# EAGLE design AJH_as3320_21_4hp (EAGLE 9.5.2)
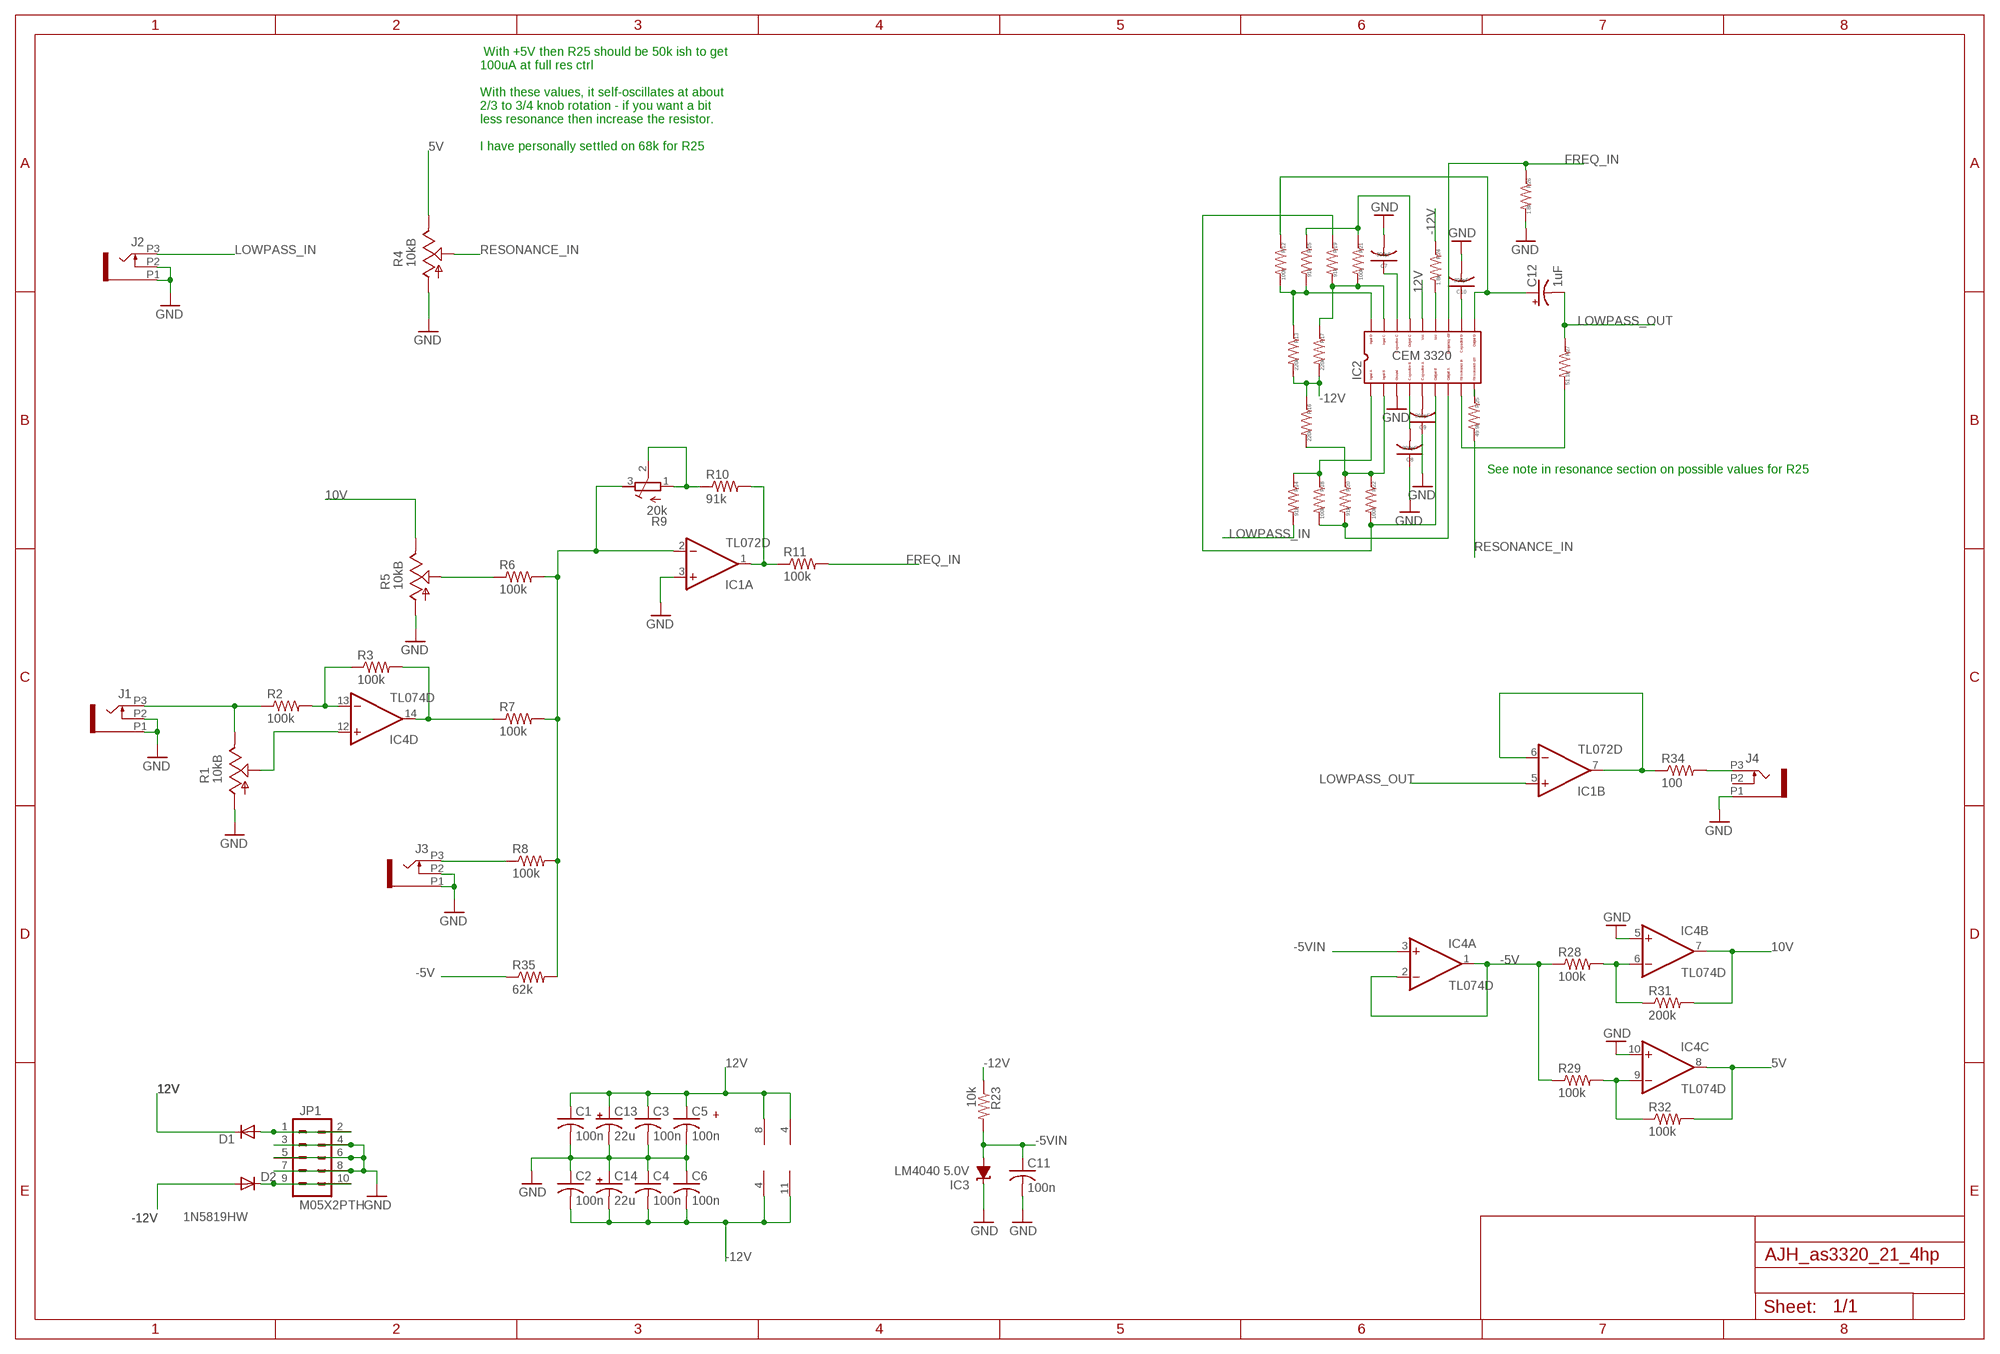
[diagram p0: schematic, sheet 1]

## Parts
C1  100n  C-USC0603  [C0603]
C2  100n  C-USC0603  [C0603]
C3  100n  C-USC0603  [C0603]
C4  100n  C-USC0603  [C0603]
C5  100n  C-USC0603  [C0603]
C6  100n  C-USC0603  [C0603]
C7  300pF  C-USC0603  [C0603]
C8  300pF  C-USC0603  [C0603]
C9  300pF  C-USC0603  [C0603]
C10  300pF  C-USC0603  [C0603]
C11  100n  C-USC0603  [C0603]
C12  1uF  CPOL-USB  [PANASONIC_B]
C13  22u  CPOL-USB  [PANASONIC_B]
C14  22u  CPOL-USB  [PANASONIC_B]
D1  1N5819HW  DIODE-SOD123  [SOD123]
D2  1N5819HW  DIODE-SOD123  [SOD123]
IC1  TL072D  [SO08]
IC2  CEM3320QFN24  [QFN24]
IC3  LM4040 5.0V  LM4041C12DBZ  [DBZ_R-PDSO-G3]
IC4  TL074D  [SO14]
J1  PJ301_THONKICONN6  [WQP_PJ_301M6]
J2  PJ301_THONKICONN6  [WQP_PJ_301M6]
J3  PJ301_THONKICONN6  [WQP_PJ_301M6]
J4  PJ301_THONKICONN6  [WQP_PJ_301M6]
JP1  M05X2PTH  [AVR_ICSP]
R1  10kB  POT_USVERTICAL  [ALPS_POT_VERTICAL]
R2  100k  R-US_R0603  [R0603]
R3  100k  R-US_R0603  [R0603]
R4  10kB  POT_USVERTICAL  [ALPS_POT_VERTICAL]
R5  10kB  POT_USVERTICAL  [ALPS_POT_VERTICAL]
R6  100k  R-US_R0603  [R0603]
R7  100k  R-US_R0603  [R0603]
R8  100k  R-US_R0603  [R0603]
R9  20k  R-TRIMM3296X  [RTRIM3296X]
R10  91k  R-US_R0603  [R0603]
R11  100k  R-US_R0603  [R0603]
R12  100k  R-US_R0603  [R0603]
R13  220k  R-US_R0603  [R0603]
R14  91k  R-US_R0603  [R0603]
R15  91k  R-US_R0603  [R0603]
R16  220k  R-US_R0603  [R0603]
R17  220k  R-US_R0603  [R0603]
R18  100k  R-US_R0603  [R0603]
R19  91k  R-US_R0603  [R0603]
R20  91k  R-US_R0603  [R0603]
R21  100k  R-US_R0603  [R0603]
R22  100k  R-US_R0603  [R0603]
R23  10k  R-US_R0603  [R0603]
R24  1.8k  R-US_R0603  [R0603]
R25  49.9k  R-US_R0603  [R0603]
R26  1.8k  R-US_R0603  [R0603]
R27  51.1k  R-US_R0603  [R0603]
R28  100k  R-US_R0603  [R0603]
R29  100k  R-US_R0603  [R0603]
R31  200k  R-US_R0603  [R0603]
R32  100k  R-US_R0603  [R0603]
R34  100  R-US_R0603  [R0603]
R35  62k  R-US_R0603  [R0603]

## Nets
5V [power]: IC4.8(C:OUT) R4.P$1(E) R32.2
10V [power]: IC4.7(B:OUT) R5.P$1(E) R31.2
12V [power]: C1.1 C3.1 C5.1 C13.+ D1.C IC1.8(P:V+) IC2.P$22 IC4.4(P:V+)
-5V [power]: IC4.1(A:OUT) IC4.2(A:-IN) R28.1 R29.1 R35.1
-5VIN [power]: C11.1 IC3.2(A) IC4.3(A:+IN) R23.2
-12V [power]: C2.2 C4.2 C6.2 C14.- D2.A IC1.4(P:V-) IC4.11(P:V-) R13.2 R16.1 R17.2 R23.1 R24.1
FREQ_IN: IC2.P$19 R11.2 R26.1
GND [power]: C1.2 C2.1 C3.2 C4.1 C5.2 C6.1 C7.2 C8.1 C9.1 C10.2 C11.2 C13.- C14.+ IC1.3(A:+IN) IC2.P$7 IC3.1(C) IC4.5(B:+IN) IC4.10(C:+IN) J1.P1 J1.P2 J2.P1 J2.P2 J3.P1 J3.P2 J4.P1 JP1.3 JP1.4 JP1.5 JP1.6 JP1.7 JP1.8 R1.P$3(A) R4.P$3(A) R5.P$3(A) R26.2
LOWPASS_IN: J2.P3 R14.2
LOWPASS_OUT: C12.- IC1.5(B:+IN) R27.1
N$1: IC1.6(B:-IN) IC1.7(B:OUT) R34.1
N$2: IC2.P$3 R12.2 R13.1 R15.2
N$3: IC4.12(D:+IN) R1.P$2(S)
N$4: R5.P$2(S) R6.1
N$5: IC4.13(D:-IN) R2.2 R3.1
N$6: D1.A JP1.1 JP1.2
N$7: IC1.2(A:-IN) R6.2 R7.2 R8.2 R9.3(A) R35.2
N$8: IC1.1(A:OUT) R10.2 R11.1
N$10: J3.P3 R8.1
N$11: J4.P3 R34.2
N$12: IC4.14(D:OUT) R3.2 R7.1
N$13: IC4.9(C:-IN) R29.2 R32.1
N$15: IC4.6(B:-IN) R28.2 R31.1
N$20: D2.C JP1.9 JP1.10
N$40: C7.1 IC2.P$24
N$41 [nearfilter]: C8.2 IC2.P$8
N$42 [nearfilter]: C9.2 IC2.P$9
N$43 [nearfilter]: C10.1 IC2.P$17
N$44 [nearfilter]: IC2.P$15 R25.1
N$45 [nearfilter]: IC2.P$4 R14.1 R18.1
N$46 [nearfilter]: IC2.P$12 R18.2 R20.2
N$47 [nearfilter]: IC2.P$11 R19.1 R22.2
N$49 [nearfilter]: IC2.P$23 R15.1 R21.1
N$50 [nearfilter]: C12.+ IC2.P$16 R12.1
N$51 [nearfilter]: IC2.P$14 R27.2
N$52 [nearfilter]: IC2.P$5 R16.2 R20.1 R22.1
N$53 [nearfilter]: IC2.P$2 R17.1 R19.2 R21.2
N$54 [nearfilter]: IC2.P$20 R24.2
N$55: R9.1(E) R9.2(S) R10.1
N$82: J1.P3 R1.P$1(E) R2.1
RESONANCE_IN: R4.P$2(S) R25.2
Unconnected: J4.P2

## Notes on the sheet
- With +5V then R25 should be 50k ish to get
  100uA at full res ctrl
  
  With these values, it self-oscillates at about
  2/3 to 3/4 knob rotation - if you want a bit
  less resonance then increase the resistor.
  
  I have personally settled on 68k for R25
- See note in resonance section on possible values for R25
- +

## Library data of the parts
C1-C6 C11 = rcl:C-US: CAPACITOR, American symbol
C7-C10 = rcl:C-US: CAPACITOR, American symbol; SPICEPREFIX: C
C12 = rcl:CPOL-US: POLARIZED CAPACITOR, American symbol; SPICEPREFIX: C
C13 C14 = rcl:CPOL-US: POLARIZED CAPACITOR, American symbol
D1 D2 = diode:DIODE-: DIODE
IC1 = linear:TL072: OP AMP
IC2 = CEM:CEM3320: CEM 3330 VCF
IC3 = texas:LM4041: PRECISION MICROPOWER SHUNT VOLTAGE REFERENCE Source: http://focus.ti.com/lit/ds/slcs146e/slcs146e.pdf
IC4 = linear:TL074: OP AMP
J1-J4 = og-pj301_variations:PJ301_THONKICONN
JP1 = og-header:M05X2: Header 5x2 Standard 10-pin dual row 0.1" header. Commonly used with AVR-ISP. Use with Spark Fun Electronics SKU: PRT-00778
R1 R4 R5 = og-pots:POT_US
R2 R3 R6-R8 R10 R11 R23 R28 R29 R31 R32 R34 R35 = resistor:R-US_: RESISTOR, American symbol
R9 = rcl:R-TRIMM: Trimm resistor
R12-R22 R24-R27 = rcl:R-US_: RESISTOR, American symbol; SPICEPREFIX: R

## Net classes
0 default: width 0.152 mm
1 power: width 0.406 mm
2 nearfilter: width 0.152 mm

## Board
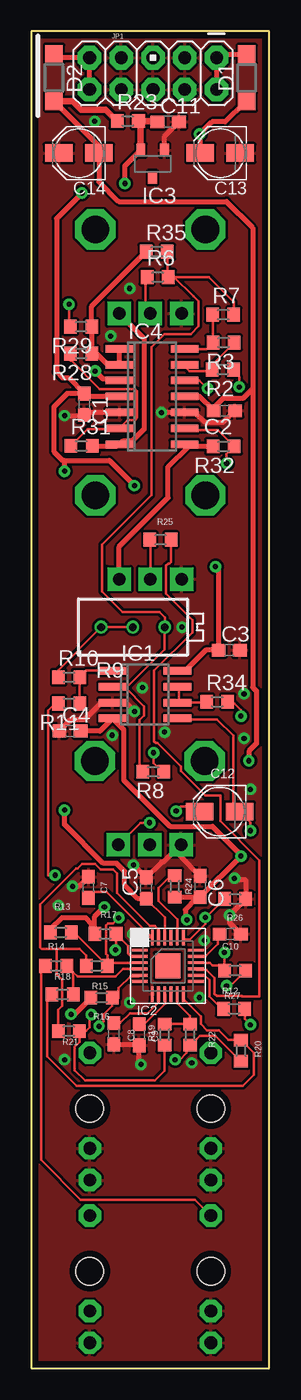
[diagram p1: board, top side]
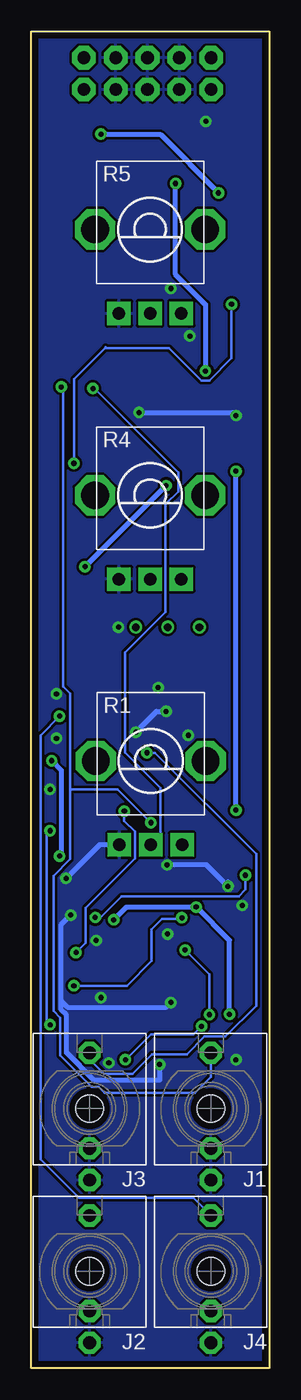
[diagram p2: board, bottom side, seen from below]

Size 19.03 x 106.76 mm. Coordinates in mm from the lower left corner, seen from the top.
Outline: 0,0 19.03,0 19.03,106.76 0,106.76 0,0
Copper layers (1*16): Top 0.035mm / dielectric 1.5mm / Bottom 0.035mm
Design rules "Mutable_PCBCart-Standard": minimum track width 8mil, minimum drill 0.4mm, track to track 8mil, track to pad 8mil, pad to pad 8mil, via to via 8mil, smd to smd 8mil, copper to edge 20mil, drill to drill 8mil, minimum pad ring 8mil, minimum via ring 10mil, stop-mask expansion 3mil, vias tented up to drill 25mil, thermal gap 8mil

### Footprints (pad centres in the part's own frame; a part is rotated, then mirrored left to right if it is on the bottom)
C0603 = smd 1.1 x 1: 1 -0.85,0; 2 0.85,0
PANASONIC_B = smd 2.2 x 1.4: + 1.6,0; - -1.6,0
SOD123 = smd 1.4 x 1.4: A 1.9,0; C -1.9,0
SO08 = smd 0.6 x 2.2: 1 -1.905,-2.6; 2 -0.635,-2.6; 3 0.635,-2.6; 4 1.905,-2.6; 5 1.905,2.6; 6 0.635,2.6; 7 -0.635,2.6; 8 -1.905,2.6
QFN24 = smd 1.25 x 0.23: P$1 -2.25,1.25; P$2 -2.25,0.75; P$3 -2.25,0.25; P$4 -2.25,-0.25; P$5 -2.25,-0.75; P$6 -2.25,-1.25; P$13 2.25,-1.25; P$14 2.25,-0.75; P$15 2.25,-0.25; P$16 2.25,0.25; P$17 2.25,0.75; P$18 2.25,1.25 | smd 0.23 x 1.25: P$7 -1.25,-2.25; P$8 -0.75,-2.25; P$9 -0.25,-2.25; P$10 0.25,-2.25; P$11 0.75,-2.25; P$12 1.25,-2.25; P$19 1.25,2.25; P$20 0.75,2.25; P$21 0.25,2.25; P$22 -0.25,2.25; P$23 -0.75,2.25; P$24 -1.25,2.25 | smd 2 x 2: PAD 0,0
DBZ_R-PDSO-G3 = smd 0.7 x 1: 1 -0.95,-1.1; 2 0.95,-1.1; 3 0,1.1
SO14 = smd 0.6 x 2.2: 1 -3.81,-2.6; 2 -2.54,-2.6; 3 -1.27,-2.6; 4 0,-2.6; 5 1.27,-2.6; 6 2.54,-2.6; 7 3.81,-2.6; 8 3.81,2.6; 9 2.54,2.6; 10 1.27,2.6; 11 0,2.6; 12 -1.27,2.6; 13 -2.54,2.6; 14 -3.81,2.6
WQP_PJ_301M6 = drill 1.016 pad 1.778 octagon: P1 0,-5.715; P2 0,-3.175; P3 0,4.445 | hole 2.2: 0,0
AVR_ICSP = drill 1.016 pad 1.88 octagon: 1 -1.27,5.08; 2 1.27,5.08; 3 -1.27,2.54; 4 1.27,2.54; 5 -1.27,0; 6 1.27,0; 7 -1.27,-2.54; 8 1.27,-2.54; 9 -1.27,-5.08; 10 1.27,-5.08
ALPS_POT_VERTICAL = drill 1 pad 1.88 square: P$1 -2.5,6.7; P$2 0,6.7; P$3 2.5,6.7 | drill 2.2 pad 3.175 octagon: P$4 -4.4,0; P$5 4.4,0
R0603 = smd 1 x 1.1: 1 -0.85,0; 2 0.85,0
RTRIM3296X = drill 0.61: 1 0,-2.54; 2 0,0; 3 0,2.54

### Placement (x,y rotation side)
C1  4.24,76.98 270 top
C2  15.44,76.46 180 top
C3  15.83,57.34 0 top
C4  3.1,50.88 0 top
C5  9.19,38.34 90 top
C6  13.5,38.47 270 top
C7  4.57,38.39 90 top
C8  6.6,26.71 90 top
C9  8.64,26.63 90 top
C10  15.91,34.67 0 top
C11  10.95,99.53 0 top
C12  15.06,44.45 180 top
C13  15.11,97.03 180 top
C14  3.81,97.03 180 top
D1  17.23,103.04 90 top
D2  1.83,103.06 270 top
IC1  9.09,53.79 270 top
IC2  10.92,32.13 0 top
IC3  9.7,96.17 180 top
IC4  9.65,77.6 270 top
J1  4.67,20.74 0 bottom
J2  14.37,7.75 0 bottom
J3  14.37,20.74 0 bottom
J4  4.67,7.75 0 bottom
JP1  9.74,103.38 270 top
R1  9.47,48.49 180 bottom
R2  15.32,79.75 180 top
R3  15.38,81.9 180 top
R4  9.53,69.71 180 bottom
R5  9.53,90.93 180 bottom
R6  10.11,87.13 0 top
R7  15.35,84.13 0 top
R8  9.75,47.63 180 top
R9  8.13,59.18 270 top
R10  3.02,55.17 0 top
R11  3.02,53.09 180 top
R12  16.3,31.75 0 top
R13  2.37,34.8 180 top
R14  1.99,32.13 180 top
R15  5.25,32.13 0 top
R16  5.63,29.59 0 top
R17  5.93,34.67 180 top
R18  2.5,29.84 180 top
R19  10.67,26.63 270 top
R20  16.76,25.36 90 top
R21  3.01,26.92 0 top
R22  12.7,26.63 90 top
R23  7.73,99.59 0 top
R24  11.47,38.48 90 top
R25  10.33,66.17 180 top
R26  16.3,37.47 0 top
R27  16.22,28.7 180 top
R28  3.98,81.03 180 top
R29  3.98,83.17 180 top
R31  4.02,73.65 0 top
R32  15.39,73.61 180 top
R34  14.86,53.21 0 top
R35  10.03,89.15 0 top

### Tracks (layer width: path | path; a pad name or v marks a point on that pad's centre or on a via)
5V
  Top 0.406: R32.2 12.57,73.61 | 12.57,73.61 12.43,73.61 IC4.8 | R4.P$1 7.03,65.6 10.95,69.52 10.95,71.98 12.57,73.61
10V
  Top 0.406: R31.2 6.92,73.65 IC4.7 7.29,74.02 8.04,74.02 9.02,74.99 9.02,82.23 R5.P$1
12V  (via drill 0.41)
  Top 0.203: IC2.P$22 10.67,36 C5.1
  Top 0.406: D1.C 17.1,101.14 15.49,99.54 14.45,99.54 v13.46,98.55 13.51,98.5 C13.+ | C1.1 2.97,79.1 2.49,79.1 2.02,79.57 2.02,91.81 v4.06,93.85 | v8.26,70.48 6.25,72.49 2.67,72.49 | 2.67,72.49 2.52,72.49 1.8,73.21 1.8,76.77 2.87,77.83 C1.1 | v14.73,64.01 14.98,63.76 C3.1 13.96,57.34 12.31,55.7 IC1.8 | C5.1 8.55,37.49 7.46,38.58 7.46,39.69 6.82,40.32 5.76,40.32 2.67,43.41 v2.67,44.58 | v2.67,71.63 2.67,72.49 | IC4.4 4.48,77.6 C1.1
  Bottom 0.406: v4.06,93.85 4.06,93.88 8.71,98.52 13.43,98.52 v13.46,98.55 | v8.26,70.48 v14.73,64.01 | v2.67,44.58 v2.67,71.63
-5V
  Top 0.406: IC4.1 IC4.2 6.11,80.14 5.22,81.03 R28.1 R29.1 4.83,84.81 R35.1
-5VIN  (via drill 0.41)
  Top 0.406: IC4.3 6.92,78.99 5.74,78.99 v5.11,79.63 | v7.49,94.61 7.49,96.02 IC3.2
  Top 0.508: C11.1 10.04,99.59 R23.2 8.75,99.42 IC3.2
  Bottom 0.406: v5.11,79.63 5.11,79.76 5.09,79.77 5.09,84.94 7.49,87.34 v7.49,94.61
-12V  (via drill 0.41)
  Top 0.406: IC4.11 13.45,77.6 C2.2 14.59,76.71 15.35,77.47 16.98,77.47 17.72,78.22 | R24.1 13.34,37.63 13.21,37.5 | R13.2 1.52,35.03 2.45,35.96 4.38,35.96 4.84,35.49 4.84,34.91 R17.2 5.08,36.07 v5.84,36.83 | v12.45,35.81 12.32,35.94 12.32,36.62 13.21,37.5 | 13.21,37.5 13.62,37.5 C6.2 16.76,40.88 v16.76,40.89 16.76,40.99 14.48,43.27 11.08,43.27 7.41,46.94 7.41,50.97 IC1.4 5.49,50.88 C4.2 | v17.4,48.51 17.4,49.28 18.01,49.89 18.01,54.08 17.72,54.37 17.72,78.22 | D2.A 5.41,97.58 C14.- 5.41,94.74 6.99,93.16 15.62,93.16 17.72,91.06 17.72,78.22 | 4.5,29.59 R16.1 3.45,28.26 v3.17,28.26
  Top 0.508: D2.A 3.32,101.16 3.97,100.51 5.96,100.51 R23.1
  Bottom 0.406: v12.45,35.81 11.43,36.83 v5.84,36.83 3.17,34.16 v3.17,28.26 | v17.4,48.51 16.64,47.75 16.64,41.02 v16.76,40.89
FREQ_IN  (via drill 0.41)
  Top 0.203: IC2.P$19 12.3,34.25 12.68,34.25 13.91,35.49 v13.91,36 14.11,36.2 14.18,36.2 R26.1 | v1.91,39.37 1.34,39.37 1.34,52.51 1.92,53.09 R11.2
  Bottom 0.203: v13.91,36 13.5,36 11.81,37.69 2.44,37.69 1.91,38.23 v1.91,39.37
GND  (via drill 0.4, 0.41)
  Top 0.406: IC3.1 10.65,98.38 C11.2 | 4.17,76.2 4.18,76.19 | 4.18,76.19 C1.2 4.18,76.07 v2.67,76.07 | IC4.10 13.04,76.33 | 9.19,39.38 C5.2 | C7.2 3.81,38.48 v3.3,38.48 | C5.2 9.19,39.24 | 13.42,39.32 C6.1 11.93,40.89 11.93,41.79 | C8.1 8.59,25.86 | C9.1 8.59,25.73 8.59,24.43 v8.76,24.26 | v16.26,39.12 16.38,38.99 17.14,38.99 R26.2 v15.88,36.2 15.88,35.56 C10.2 | C4.1 3.16,51.8 4.26,51.8 5.62,53.16 IC1.3 7.55,53.16 v8.26,52.45 | 10.67,50.86 v10.67,50.8 | IC4.10 13.1,76.33 13.87,75.55 15.39,75.55 C2.1 | IC4.5 4.32,76.33 4.18,76.19 | IC4.10 v10.41,76.33 | C5.2 10.44,40.44 10.58,40.44 11.93,41.79 | 11.93,41.79 R1.P$3 | C5.2 9.17,39.19 v8.17,40.19
  Bottom 0.406: 3.3,38.83 v3.3,38.48 5.01,40.19 v8.17,40.19 | v8.26,52.45 9.02,52.45 v10.67,50.8 | v15.88,36.2 16.64,35.43 16.64,29.34 | v10.41,76.33 2.92,76.33 v2.67,76.07 | v8.76,24.26 8.76,22.99 14,22.99 16.22,25.2 16.22,28.2 16.64,28.62 16.64,29.34 | v7.87,29.21 8.26,28.83 16.13,28.83 16.64,29.34 | R1.P$3 13.58,41.79 v16.26,39.12
  other vias: 12.83,24.38 2.67,24.64 17.02,53.85 17.53,46.23 6.48,50.55 13.84,34.16 8.13,34.67 13.46,29.59 2.16,36.96 12.06,59.18 6.35,82.42 7.87,86.23 5.08,99.57 8.89,54.36 17.02,50.29
  pour Top: -0.89,107.7 19.43,107.7 20.07,107.06 20.32,106.81 20.32,-0.25 19.3,-1.27 -0.25,-1.27 -0.89,-0.64
  pour Bottom: -1.4,108.33 20.07,108.33 20.07,-0.64 -1.14,-0.64 -1.4,-0.38
LOWPASS_IN
  Top 0.203: R14.2 0.8,31.78 0.8,16.62 3.95,13.46 13.1,13.46 J2.P3
LOWPASS_OUT  (via drill 0.41)
  Top 0.203: v17.53,27.43 17.07,27.89 R27.1 | v17.53,42.93 17.53,43.59 C12.- 16.15,44.96 16.15,50.52 14.86,51.82 11.76,51.82 IC1.5
  Bottom 0.203: v17.53,27.43 17.78,27.69 17.78,42.67 v17.53,42.93
N$1
  Top 0.203: 12.69,53.03 11.82,53.03 | 11.82,53.03 IC1.6 13.95,53.16 R34.1 | IC1.7 11.82,54.3 11.82,53.03
N$2  (via drill 0.41)
  Top 0.203: v15.62,30.54 15.94,30.54 R12.2 | R15.2 6.35,32.38 IC2.P$3 | R15.2 3.43,34.8 R13.1 | v6.99,35.97 6.54,35.53 6.15,35.53 5.97,35.34 5.97,33.09 6.1,32.96 R15.2
  Bottom 0.203: v15.62,30.54 11.37,30.54 9.4,32.51 9.4,35.05 8.57,35.88 7.07,35.88 v6.99,35.97
N$3  (via drill 0.41)
  Top 0.203: 12.25,78.74 IC4.12 13.46,78.87 v14.1,78.23
  Bottom 0.203: v14.1,78.23 13.97,78.23 7.27,71.53 7.27,70.02 8.28,69 8.28,60.4 11.54,57.14 11.54,49.16 8.71,46.34 8.71,42.55 R1.P$2
N$4
  Top 0.203: R6.1 9.14,87.02 9.14,84.61 R5.P$2
N$5
  Top 0.203: R3.1 14.47,80.15 R2.2 14.35,79.62 12.64,79.62 12.25,80.01 IC4.13
N$6
  Top 0.406: JP1.2 JP1.1 15.11,104.94 D1.A
N$7
  Top 0.203: 11.43,87.13 R6.2 10.88,87.2 R35.2 | 11.43,87.13 12.96,85.6 13.36,85.21 13.36,83.2 12.76,82.6 10.67,82.6 9.6,81.53 9.6,69.71 5.66,65.77 5.66,62.01 7.29,60.38 10.24,60.38 10.67,59.94 R9.3 10.67,57.4 7.69,54.43 IC1.2 6.6,54.43 6.73,54.3 7.56,54.3 9.02,52.84 9.02,52.13 8.65,51.77 8.65,47.89 R8.2 | R7.2 16.2,85.14 14.21,87.13 11.43,87.13
N$8
  Top 0.203: R11.1 R10.2 4.39,55.7 6.39,55.7 | 6.39,55.7 6.38,55.68 | 6.39,55.7 IC1.1
N$10  (via drill 0.41)
  Top 0.203: v9.78,49.15 9.78,48.33 10.48,47.63 R8.1
  Bottom 0.203: v9.78,49.15 9.14,49.15 1.04,41.05 1.04,28.93 3.49,26.48 5.17,26.48 6.6,25.05 9.37,25.05 10.93,23.5 13.19,23.5 14.37,24.67 J3.P3
N$11  (via drill 0.41)
  Top 0.203: v16.76,52.07 16.76,52.58 16.26,53.09 15.84,53.09 R34.2
  Bottom 0.203: v16.76,52.07 18.29,50.55 18.29,16.66 15.21,13.59 6.07,13.59 J4.P3
N$12
  Top 0.203: R7.1 14.53,84.1 R3.2 14.02,81.39 12.49,81.39 12.38,81.28 IC4.14
N$13  (via drill 0.41)
  Top 0.203: IC4.9 12.38,74.93 14.92,74.93 R32.1 15.62,72.99 v15.62,72.26 | v3.01,84.96 3.01,83.29 R29.2
  Bottom 0.203: v15.62,72.26 15.62,79 13.15,81.47 | 13.15,81.47 13.09,81.53 | 13.15,81.47 8.03,81.47 5.42,78.87 4.79,78.87 3.01,80.64 v3.01,84.96
N$15
  Top 0.203: 3.58,73.65 R31.1 4.51,75 7.05,75 IC4.6 7.72,75.72 8.28,75.72 8.46,75.9 8.46,78.02 8.28,78.2 5.46,78.2 3.13,80.52 R28.2 3.13,80.47
N$20
  Top 0.406: D2.C 2.14,104.65 JP1.9 JP1.10
N$40
  Top 0.203: 9.54,34.38 IC2.P$24 6,38.05 5.08,38.05 C7.1
N$41
  Top 0.203: C8.2 7.11,27.56 7.88,28.34 9.3,28.34 10.17,29.21 IC2.P$8
N$42
  Top 0.203: IC2.P$9 10.72,29.83 10.72,29.13 9.07,27.48 C9.2
N$43
  Top 0.203: IC2.P$17 13.93,32.88 14.94,33.88 14.94,34.54 C10.1
N$44
  Top 0.203: R25.1 11.18,64.38 11.05,64.26 10.96,64.26 10.78,64.08 10.78,61.85 12.88,59.75 12.88,58.75 9.83,55.7 9.83,50.06 9.98,49.91 10.1,49.91 11.96,48.04 11.96,47.7 13.94,45.72 15.11,45.72 15.11,43.68 18.25,40.54 18.25,29.71 16.85,29.71 16.84,29.72 14.82,29.72 14.63,29.91 14.63,31.16 14,31.8 13.25,31.8 IC2.P$15
N$45
  Top 0.203: R14.1 3.35,31.62 | 3.35,31.62 R18.1 | IC2.P$4 7.33,31.88 6.72,31.28 3.7,31.28 3.35,31.62
N$46
  Top 0.203: IC2.P$12 12.17,29.49 13.55,28.11 13.55,27.48 14.06,26.97 14.99,26.97 15.75,26.21 R20.2 17.8,25.18 17.8,23.41 16.93,22.54 3.62,22.54 1.27,24.89 1.27,29.46 R18.2
N$47
  Top 0.203: IC2.P$11 11.67,29.14 12.7,28.12 R22.2 R19.1
N$49
  Top 0.203: IC2.P$23 10.17,35.05 9.91,35.31 9.5,35.31 6.86,37.95 6.86,39.5 6.54,39.81 5.55,39.81 5.1,40.26 4.06,40.26 3.72,39.92 3.6,39.92 0.72,37.04 0.72,33.6 0.82,33.49 2.03,33.49 | R15.1 4.4,32.95 3.85,33.49 2.03,33.49 | 2.32,27.09 R21.1 2.16,28.62 2.46,28.91 2.46,31.04 2.04,31.45 2.04,33.49 2.03,33.49
N$50  (via drill 0.41)
  Top 0.203: IC2.P$16 14.28,32.38 14.49,32.17 15.02,32.17 R12.1 v15.45,33.19 | v11.59,44.48 11.97,44.87 13.05,44.87 C12.+
  Bottom 0.203: v15.45,33.19 14.69,33.95 14.69,36.77 10.73,40.72 10.73,42.86 11.59,43.72 v11.59,44.48
N$51
  Top 0.203: R27.2 15.34,28.68 15.24,28.68 14.23,29.69 14.23,31 13.84,31.38 IC2.P$14
N$52  (via drill 0.41)
  Top 0.203: R20.1 14.72,26.55 13.47,26.55 R22.1 12.42,25.78 12.42,25.18 11.88,24.64 v11.5,24.64 | IC2.P$5 8.59,31.3 7.92,31.3 6.99,30.36 6.99,29.59 R16.2 6.48,28.91 5.8,28.23 5.8,27.68 v5.42,27.3
  Bottom 0.203: v5.42,27.3 6.06,26.67 9.46,26.67 v11.5,24.64
N$53  (via drill 0.41)
  Top 0.203: 6.96,22.99 7.11,22.99 | 7.11,22.99 9.91,22.99 10.67,23.75 R19.2 | IC2.P$2 8,32.88 7.74,33.14 7.74,33.71 R17.1 6.78,33.45 v6.73,33.4 | 7.11,22.99 7.1,22.97 4.31,22.97 3.48,23.8 3.48,25.68 3.86,26.05 R21.2 4.37,26.92 4.66,27.22 4.66,28.11 v4.79,28.23
  Bottom 0.203: v4.79,28.23 4.79,31.46 v6.73,33.4
N$54
  Top 0.203: R24.2 11.16,39.33 10.18,38.35 10.18,37.32 11.67,35.83 IC2.P$20
N$55
  Top 0.203: R10.1 2.17,55.77 R9.1 R9.2
N$82  (via drill 0.4, 0.41)
  Top 0.203: R2.1 16.18,79.62 16.64,79.16 v16.64,78.36 | R1.P$1 8.74,43.56 v9.47,43.56
  Bottom 0.203: J1.P3 4.67,23.28 5.94,22.01 13.16,22.01 13.63,22.48 14.21,22.48 16.73,24.99 16.73,27.99 17.25,28.51 17.25,39.33 15.91,40.67 15.91,46.23 | v16.64,78.36 16.46,78.19 16.46,54.44 15.91,53.88 15.91,46.23 | v9.47,43.56 12.14,46.23 15.91,46.23
RESONANCE_IN
  Top 0.203: R25.2 9.53,66.12 R4.P$2